# Altium schematic sheet PowerSubsystem.SchDoc
size A4; SheetNumber: 8; SheetTotal: 14
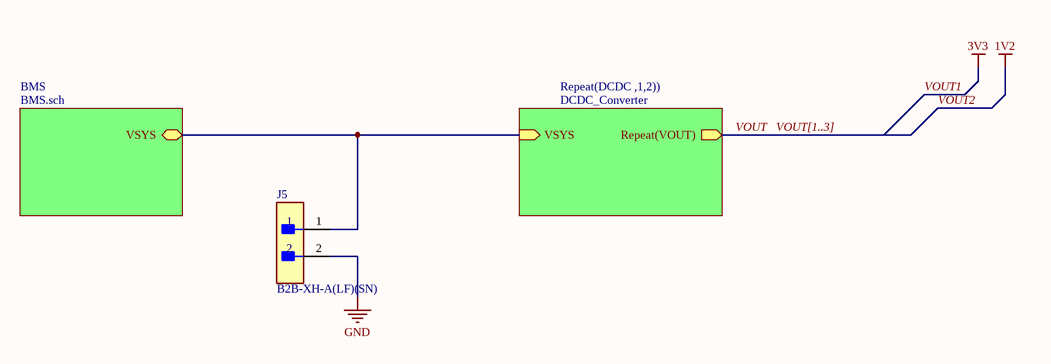
[diagram p0: PowerSubsystem.SchDoc]

## Parts
J5  B2B-XH-A(LF)(SN)  [FP-B2B-XH-A_LF_SN-MFG]

## Sub-sheets
BMS = BMS.sch: VSYS (bidir)
Repeat(DCDC ,1,2)) = DCDC_Converter: Repeat(VOUT) (out), VSYS (in)

## Nets
GND: J5.2
VOUT: sheet Repeat(DCDC ,1,2))/Repeat(VOUT)
NetJ5_1: J5.1 ; sheet BMS/VSYS, sheet Repeat(DCDC ,1,2))/VSYS

## Buses and harness runs
bus VOUT[1..3]

## Library data of the parts
J5 = CMP-2000-05888-3: CONN HEADER VERT 2POS 2.5MM; Current Rating: 3A; Voltage Rating: 250V; Number of Contacts: 2; Contact Resistance: 20mR; Wire/Cable Gauge: 22AWG; Insulation Resistance: 1GR; Connector Type: Male Pin; Packaging: Bulk; Contact Material: Brass; Lead Free: Lead Free; Orientation: Straight; Contact Plating: Tin; Max Current Rating: 3A; Termination: Solder; Fastening Type: Detent; Depth: 5.75mm; Housing Material: Polyamide; REACH SVHC: No SVHC; Series: XH; Voltage Rating (AC): 250V; Number of Positions: 2; Color: Natural; Contact Type: Male Pin; Max Voltage Rating (DC): 250V; Pitch: 2.5mm; Lead Pitch: 2.5mm; Mount: Through Hole; Max Operating Temperature: 85°C; Length: 7.4mm; Max Voltage Rating (AC): 250V; Min Operating Temperature: -25°C; Number of Rows: 1; Housing Color: White